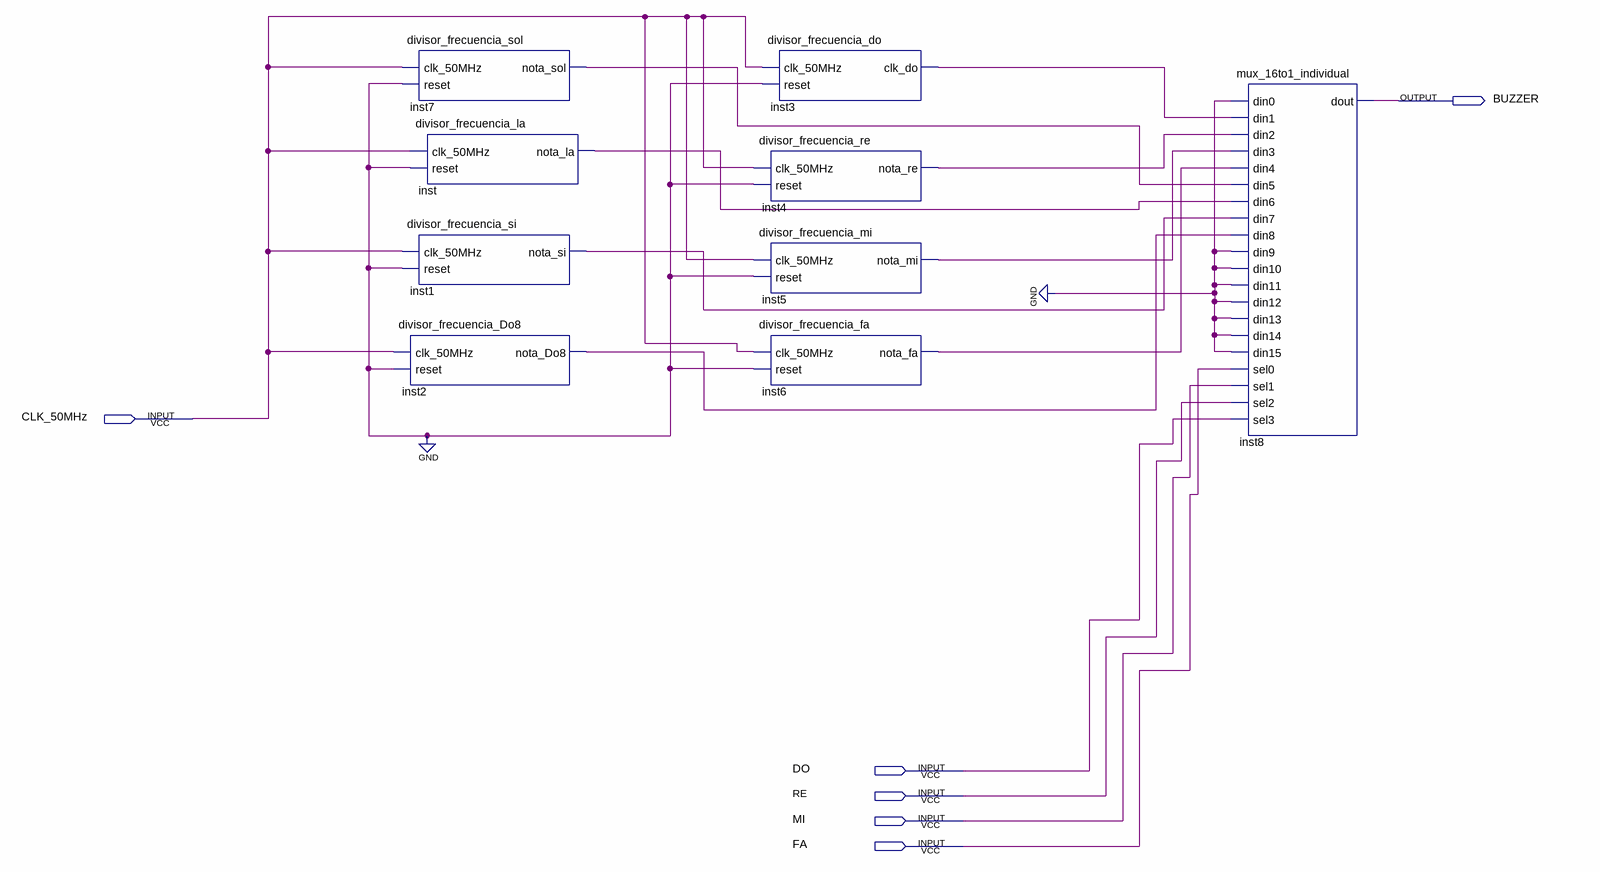
[diagram p0: schematic sheet]
// Quartus schematic Fernando_piano2.bdf as structural Verilog: 9 symbols, 6 pins
module Fernando_piano2 (
  input  CLK_50MHz,
  input  DO,
  input  RE,
  input  MI,
  input  FA,
  output BUZZER
);

  wire inst1_nota_si, inst2_nota_do8, inst3_clk_do, inst4_nota_re, inst5_nota_mi, inst6_nota_fa,
       inst7_nota_sol, inst_nota_la;

  divisor_frecuencia_sol inst7 (.clk_50MHz(CLK_50MHz), .reset(1'b0), .nota_sol(inst7_nota_sol));
  divisor_frecuencia_la inst (.clk_50MHz(CLK_50MHz), .reset(1'b0), .nota_la(inst_nota_la));
  divisor_frecuencia_si inst1 (.clk_50MHz(CLK_50MHz), .reset(1'b0), .nota_si(inst1_nota_si));
  divisor_frecuencia_Do8 inst2 (.clk_50MHz(CLK_50MHz), .reset(1'b0), .nota_Do8(inst2_nota_do8));
  divisor_frecuencia_do inst3 (.clk_50MHz(CLK_50MHz), .reset(1'b0), .clk_do(inst3_clk_do));
  divisor_frecuencia_re inst4 (.clk_50MHz(CLK_50MHz), .reset(1'b0), .nota_re(inst4_nota_re));
  divisor_frecuencia_mi inst5 (.clk_50MHz(CLK_50MHz), .reset(1'b0), .nota_mi(inst5_nota_mi));
  divisor_frecuencia_fa inst6 (.clk_50MHz(CLK_50MHz), .reset(1'b0), .nota_fa(inst6_nota_fa));
  mux_16to1_individual inst8 (
    .din0(1'b0), .din1(inst3_clk_do), .din2(inst4_nota_re), .din3(inst5_nota_mi), .din4(inst6_nota_fa),
    .din5(inst7_nota_sol), .din6(inst_nota_la), .din7(inst1_nota_si), .din8(inst2_nota_do8), .din9(1'b0),
    .din10(1'b0), .din11(1'b0), .din12(1'b0), .din13(1'b0), .din14(1'b0), .din15(1'b0), .sel0(FA), .sel1(MI),
    .sel2(RE), .sel3(DO), .dout(BUZZER));
endmodule
